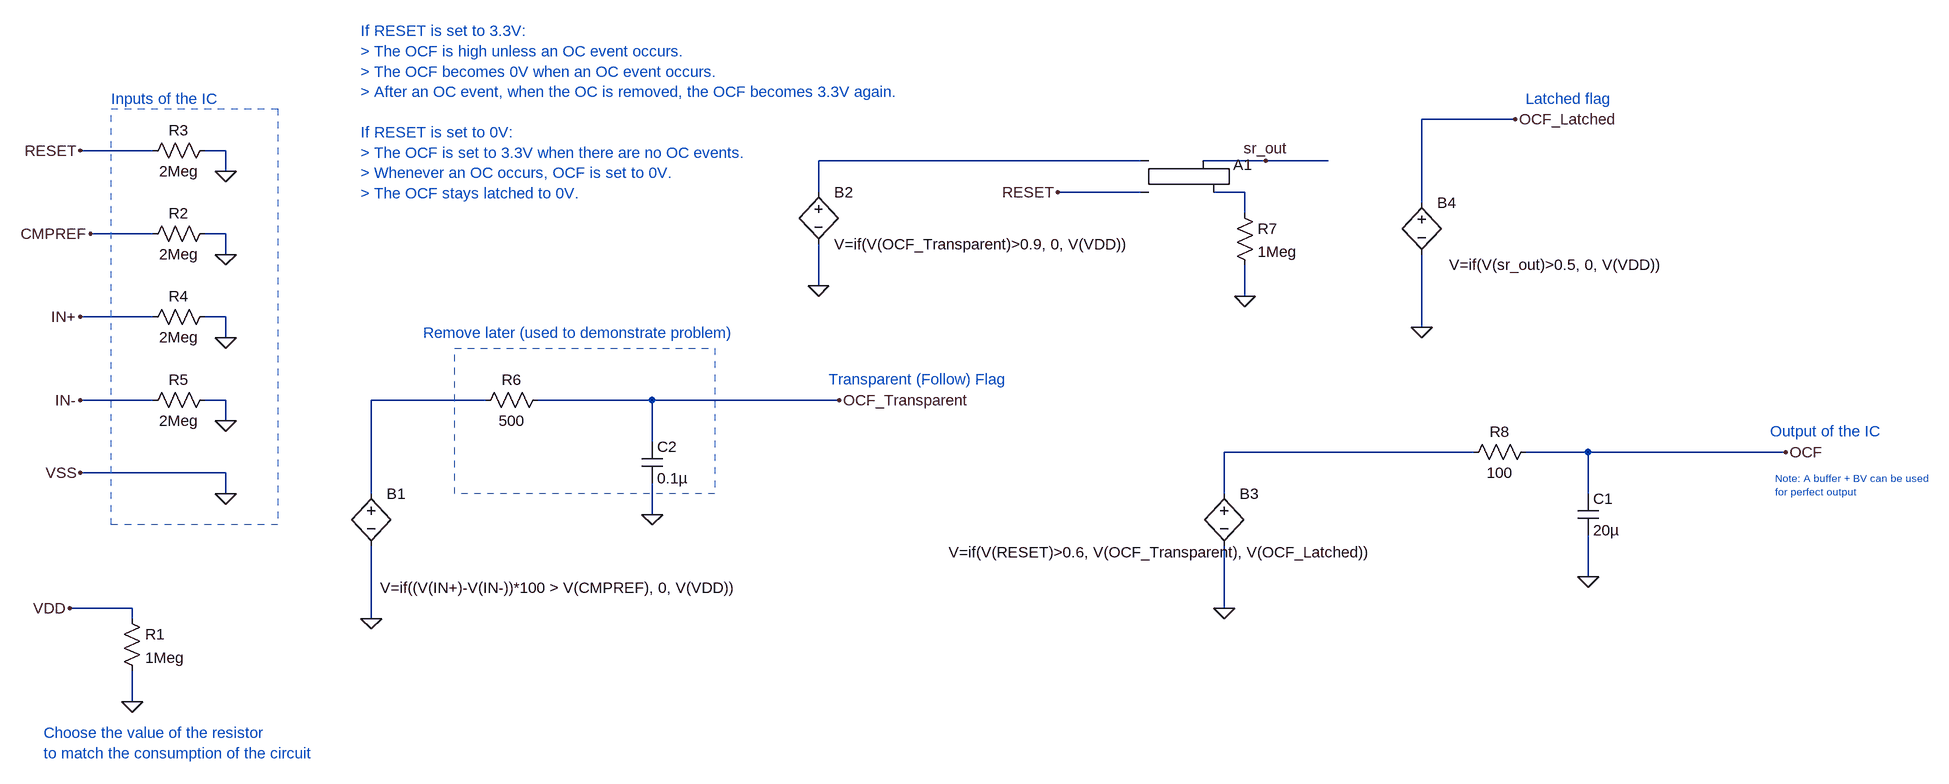
[diagram p0: schematic INA381A1.asc]
INA381A1.asc, the LTspice schematic file:
Version 4
SHEET 1 2840 700
WIRE 1632 -288 1488 -288
WIRE -464 -240 -576 -240
WIRE -352 -240 -384 -240
WIRE 1056 -224 560 -224
WIRE 1248 -224 1152 -224
WIRE 1344 -224 1248 -224
WIRE -352 -208 -352 -240
WIRE 560 -176 560 -224
WIRE 1056 -176 928 -176
WIRE 1216 -176 1168 -176
WIRE 1488 -160 1488 -288
WIRE 1216 -144 1216 -176
WIRE -464 -112 -560 -112
WIRE -352 -112 -384 -112
WIRE -352 -80 -352 -112
WIRE 560 -32 560 -96
WIRE 1216 -16 1216 -64
WIRE -464 16 -576 16
WIRE -352 16 -384 16
WIRE 1488 32 1488 -80
WIRE -352 48 -352 16
WIRE -464 144 -576 144
WIRE -352 144 -384 144
WIRE 48 144 -128 144
WIRE 304 144 128 144
WIRE 592 144 304 144
WIRE -352 176 -352 144
WIRE 304 208 304 144
WIRE 1568 224 1184 224
WIRE 1744 224 1648 224
WIRE 2048 224 1744 224
WIRE -352 256 -576 256
WIRE -352 288 -352 256
WIRE -128 288 -128 144
WIRE 1184 288 1184 224
WIRE 1744 288 1744 224
WIRE 304 320 304 272
WIRE 1744 416 1744 352
WIRE -496 464 -592 464
WIRE 1184 464 1184 368
WIRE -496 480 -496 464
WIRE -128 480 -128 368
WIRE -496 608 -496 560
FLAG -560 -112 CMPREF
FLAG -576 256 VSS
FLAG 592 144 OCF_Transparent
FLAG -576 16 IN+
FLAG -576 144 IN-
FLAG -128 480 0
FLAG -352 -80 0
FLAG -352 288 0
FLAG -352 48 0
FLAG -352 176 0
FLAG -576 -240 RESET
FLAG -352 -208 0
FLAG 560 -32 0
FLAG 928 -176 RESET
FLAG 1184 464 0
FLAG 1216 -16 0
FLAG 2048 224 OCF
FLAG 1248 -224 sr_out
FLAG 1488 32 0
FLAG 1632 -288 OCF_Latched
FLAG -592 464 VDD
FLAG -496 608 0
FLAG 1744 416 0
FLAG 304 320 0
SYMBOL bv -128 272 R0
WINDOW 3 14 161 Left 2
SYMATTR Value V=if((V(IN+)-V(IN-))*100 > V(CMPREF), 0, V(VDD))
SYMATTR InstName B1
SYMBOL res -368 -128 R90
WINDOW 0 0 56 VBottom 2
WINDOW 3 32 56 VTop 2
SYMATTR InstName R2
SYMATTR Value 2Meg
SYMBOL res -368 0 R90
WINDOW 0 0 56 VBottom 2
WINDOW 3 32 56 VTop 2
SYMATTR InstName R4
SYMATTR Value 2Meg
SYMBOL res -368 128 R90
WINDOW 0 0 56 VBottom 2
WINDOW 3 32 56 VTop 2
SYMATTR InstName R5
SYMATTR Value 2Meg
SYMBOL res -368 -256 R90
WINDOW 0 0 56 VBottom 2
WINDOW 3 32 56 VTop 2
SYMATTR InstName R3
SYMATTR Value 2Meg
SYMBOL bv 560 -192 R0
SYMATTR InstName B2
SYMATTR Value V=if(V(OCF_Transparent)>0.9, 0, V(VDD))
SYMBOL Digital\\srflop 1104 -272 R0
SYMATTR InstName A1
SYMBOL bv 1184 272 R0
WINDOW 3 -424 106 Left 2
SYMATTR Value V=if(V(RESET)>0.6, V(OCF_Transparent), V(OCF_Latched))
SYMATTR InstName B3
SYMBOL res 1200 -160 R0
SYMATTR InstName R7
SYMATTR Value 1Meg
SYMBOL res 1664 208 R90
WINDOW 0 0 56 VBottom 2
WINDOW 3 32 56 VTop 2
SYMATTR InstName R8
SYMATTR Value 100
SYMBOL bv 1488 -176 R0
WINDOW 3 42 112 Left 2
SYMATTR Value V=if(V(sr_out)>0.5, 0, V(VDD))
SYMATTR InstName B4
SYMBOL res -512 464 R0
SYMATTR InstName R1
SYMATTR Value 1Meg
SYMBOL cap 1728 288 R0
SYMATTR InstName C1
SYMATTR Value 20µ
SYMATTR SpiceLine Rser=0 Rpar=0
SYMBOL res 144 128 R90
WINDOW 0 0 56 VBottom 2
WINDOW 3 32 56 VTop 2
SYMATTR InstName R6
SYMATTR Value 500
SYMBOL cap 288 208 R0
SYMATTR InstName C2
SYMATTR Value 0.1µ
TEXT -144 -424 Left 2 ;If RESET is set to 3.3V:\n> The OCF is high unless an OC event occurs.\n> The OCF becomes 0V when an OC event occurs.\n> After an OC event, when the OC is removed, the OCF becomes 3.3V again.\n \nIf RESET is set to 0V:\n> The OCF is set to 3.3V when there are no OC events.\n> Whenever an OC occurs, OCF is set to 0V.\n> The OCF stays latched to 0V.
TEXT -528 -320 Left 2 ;Inputs of the IC
TEXT 1648 -320 Left 2 ;Latched flag
TEXT 576 112 Left 2 ;Transparent (Follow) Flag
TEXT 2024 192 Left 2 ;Output of the IC
TEXT 2032 264 Left 1 ;Note: A buffer + BV can be used \nfor perfect output
TEXT -632 656 Left 2 ;Choose the value of the resistor\nto match the consumption of the circuit
TEXT -48 40 Left 2 ;Remove later (used to demonstrate problem)
RECTANGLE Normal -272 336 -528 -304 2
RECTANGLE Normal 400 288 0 64 2

The netlist it stands for:
* INA381A1.asc
B1 N003 0 V=if((V(IN+)-V(IN-))*100 > V(CMPREF), 0, V(VDD))
R2 0 CMPREF 2Meg
R4 0 IN+ 2Meg
R5 0 IN- 2Meg
R3 0 RESET 2Meg
B2 N001 0 V=if(V(OCF_Transparent)>0.9, 0, V(VDD))
A1 N001 RESET 0 0 0 N002 sr_out 0 SRFLOP
B3 N004 0 V=if(V(RESET)>0.6, V(OCF_Transparent), V(OCF_Latched))
R7 N002 0 1Meg
R8 OCF N004 100
B4 OCF_Latched 0 V=if(V(sr_out)>0.5, 0, V(VDD))
R1 VDD 0 1Meg
C1 OCF 0 20µ Rser=0 Rpar=0
R6 OCF_Transparent N003 500
C2 OCF_Transparent 0 0.1µ
* If RESET is set to 3.3V:
* > The OCF is high unless an OC event occurs.
* > The OCF becomes 0V when an OC event occurs.
* > After an OC event, when the OC is removed, the OCF becomes 3.3V again.
* If RESET is set to 0V:
* > The OCF is set to 3.3V when there are no OC events.
* > Whenever an OC occurs, OCF is set to 0V.
* > The OCF stays latched to 0V.
* Inputs of the IC
* Latched flag
* Transparent (Follow) Flag
* Output of the IC
* Note: A buffer + BV can be used
* for perfect output
* Choose the value of the resistor
* to match the consumption of the circuit
* Remove later (used to demonstrate problem)
.backanno
.end